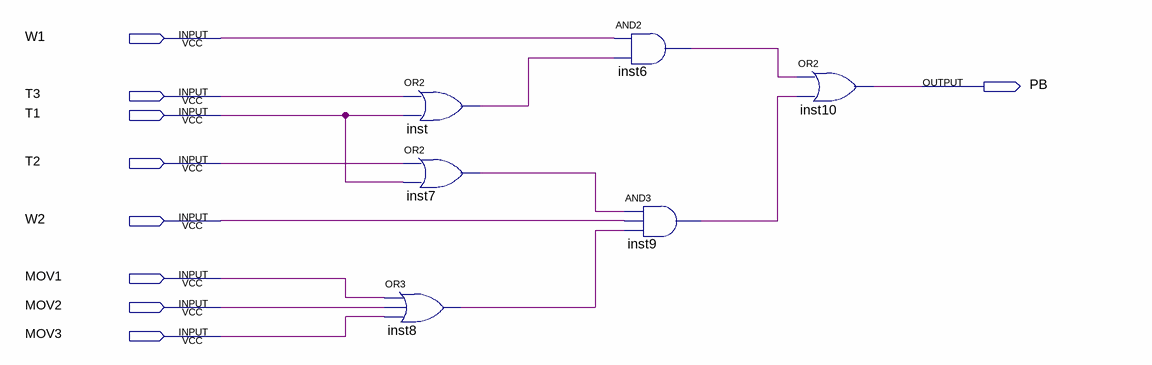
[diagram p0: schematic sheet]
// Quartus schematic PB.bdf as structural Verilog: 6 symbols, 9 pins
module PB (
  input  W1,
  input  T3,
  input  T1,
  input  T2,
  input  W2,
  input  MOV1,
  input  MOV2,
  input  MOV3,
  output PB
);

  wire inst6_out, inst7_out, inst8_out, inst9_out, inst_out;

  or inst (inst_out, T3, T1);
  or inst7 (inst7_out, T2, T1);
  or inst8 (inst8_out, MOV1, MOV2, MOV3);
  and inst6 (inst6_out, W1, inst_out);
  and inst9 (inst9_out, inst7_out, W2, inst8_out);
  or inst10 (PB, inst6_out, inst9_out);
endmodule
